# Altium schematic sheet MC1_Board_Gen2.SchDoc
size A3; SheetNumber: 1; SheetTotal: 8; DocumentSheetName: MC1-Board Gen2
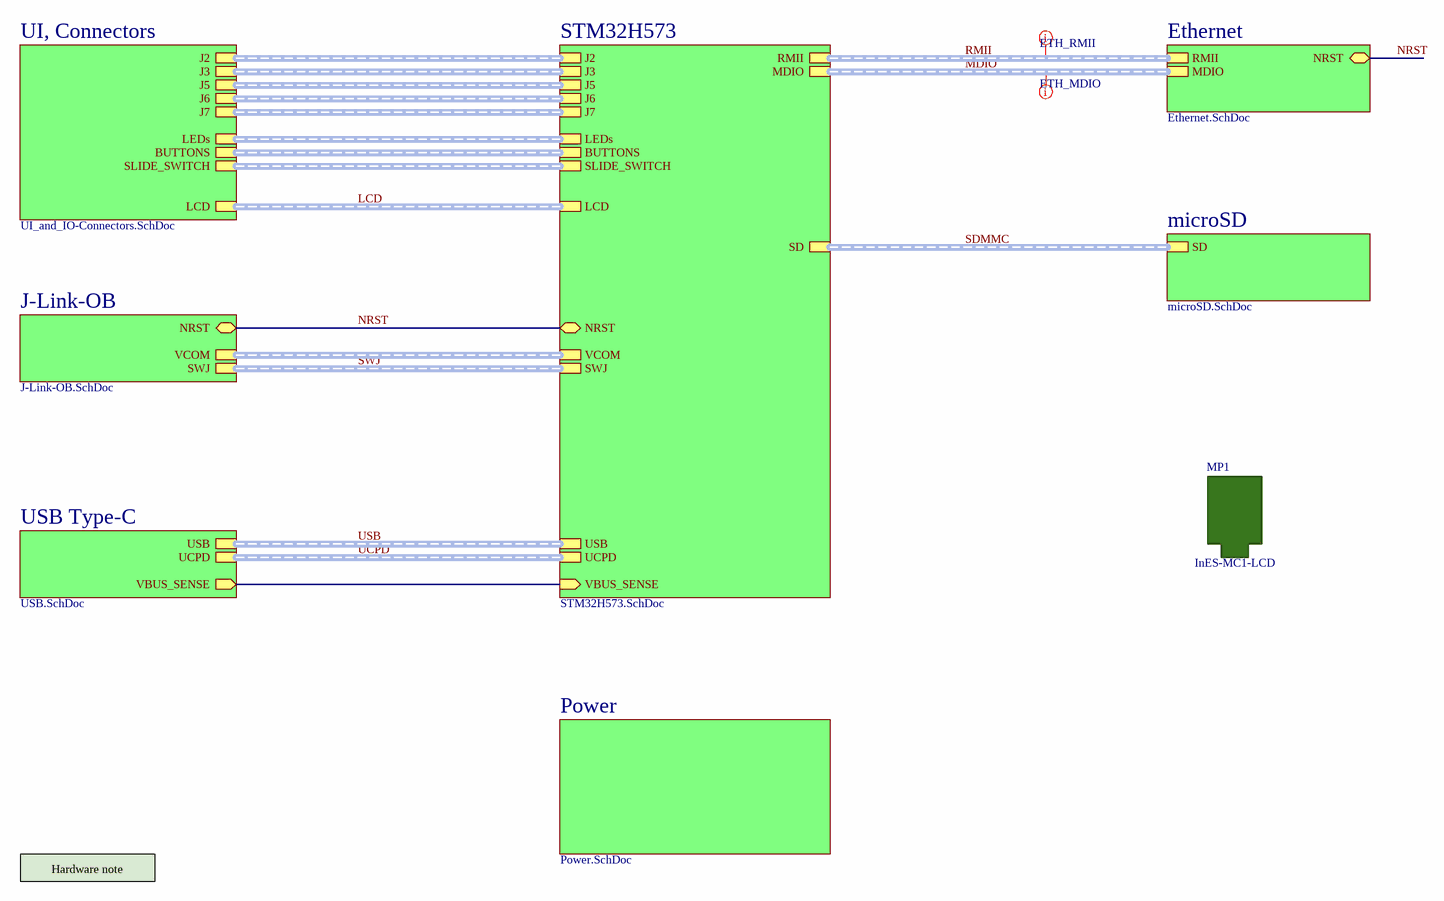
[diagram p0: MC1_Board_Gen2.SchDoc]

## Parts
MP1  InES-MC1-LCD  [InES_MC1-LCD_Board_1.01-2.5-0]  (no BOM)

## Sub-sheets
Ethernet = Ethernet.SchDoc: RMII (harness RMII), NRST (bidir), MDIO (harness MDIO)
J-Link-OB = J-Link-OB.SchDoc: SWJ (harness SWJ), VCOM (harness VCOM), NRST (bidir)
microSD = microSD.SchDoc: SD (harness SD-Bus)
Power = Power.SchDoc: no entries
STM32H573 = STM32H573.SchDoc: NRST (bidir), RMII (harness RMII), SD (harness SD-Bus), USB (harness USB), SWJ (harness SWJ), LCD (harness LCD), VCOM (harness VCOM), VBUS_SENSE (in), J7 (harness J7), J5 (harness J5), J2 (harness J2), J3 (harness J3), J6 (harness J6), LEDs (harness LEDs), BUTTONS (harness BUTTONS), SLIDE_SWITCH (harness SLIDE_SWITCH), UCPD (harness UCPD), MDIO (harness MDIO)
UI, Connectors = UI_and_IO-Connectors.SchDoc: LCD (harness LCD), J2 (harness J2), J3 (harness J3), J5 (harness J5), J6 (harness J6), J7 (harness J7), SLIDE_SWITCH (harness SLIDE_SWITCH), LEDs (harness LEDs), BUTTONS (harness BUTTONS)
USB Type-C = USB.SchDoc: USB (harness USB), VBUS_SENSE (out), UCPD (harness UCPD)

## Nets
NRST: sheet J-Link-OB/NRST, sheet Ethernet/NRST, sheet STM32H573/NRST
(unnamed): sheet USB Type-C/VBUS_SENSE, sheet STM32H573/VBUS_SENSE

## Buses and harness runs
harness LCD = sheet STM32H573/LCD = sheet UI, Connectors/LCD
harness MDIO = sheet Ethernet/MDIO = sheet STM32H573/MDIO
harness RMII = sheet Ethernet/RMII = sheet STM32H573/RMII
harness SDMMC = sheet microSD/SD = sheet STM32H573/SD
harness sheet J-Link-OB/VCOM = sheet STM32H573/VCOM
harness sheet STM32H573/BUTTONS = sheet UI, Connectors/BUTTONS
harness sheet STM32H573/J2 = sheet UI, Connectors/J2
harness sheet STM32H573/J3 = sheet UI, Connectors/J3
harness sheet STM32H573/J5 = sheet UI, Connectors/J5
harness sheet STM32H573/J6 = sheet UI, Connectors/J6
harness sheet STM32H573/J7 = sheet UI, Connectors/J7
harness sheet STM32H573/LEDs = sheet UI, Connectors/LEDs
harness sheet STM32H573/SLIDE_SWITCH = sheet UI, Connectors/SLIDE_SWITCH
harness SWJ = sheet J-Link-OB/SWJ = sheet STM32H573/SWJ
harness UCPD = sheet STM32H573/UCPD = sheet USB Type-C/UCPD
harness USB = sheet STM32H573/USB = sheet USB Type-C/USB

## Layout directives
net class ETH_RMII: (no net found under the mark)
net class ETH_MDIO: (no net found under the mark)

## Notes on the sheet
- Hardware note
- Rev
- Date
- Sign
- Release Notes
- Sheet Name
- Project Name
- Variant:
- Doc Number
- File:
- Repo:
- Revision:
- Date:
- Author:
- VC Rev:
- Sheet

## Library data of the parts
MP1 = CMP-00030-00039-1: Add-On Card, MC1 LCD Board 1.01, InES; Case/Package: n/a; Type: Add-On Card; Mounting Technology: Pluggable